# Altium schematic sheet HDMI8x8_InputConnector.SchDoc
size Letter; Date: Not shown in title block; ApprovedBy: Not shown in title block; CheckedBy: Not shown in title block; Author: Not shown in title block; CompanyName: Not shown in title block; Engineer: Not shown in title block; Organization: Not shown in title block; Address1: Not shown in title block; Address2: Not shown in title block; Address3: Not shown in title block; Address4: Not shown in title block; DocumentNumber: 1; Revision: Use project parameter SCH_Rev; SheetNumber: 2; SheetTotal: 3; PageSetup: Record=PageOptions|CenterHorizontal=True|CenterVertical=True|PrintScale=1.00|XCorrection=1.00|YCorrection=1.00|PrintKind=0|BorderSize=5000000|LeftOffset=0|BottomOffset=0|Orientation=2|PaperLength=1000|PaperWidth=1000|Scale=100|PaperSource=15|PrintQuality=600|MediaType=1|DitherType=10|PaperKind=Letter|PrintScaleMode=1; CurrentTime: Not shown in title block; CurrentDate: Not shown in title block; Time: Not shown in title block; DocumentFullPathAndName: Not shown in title block; DocumentName: Not shown in title block; ModifiedDate: Not shown in title block; ImagePath: Not shown in title block
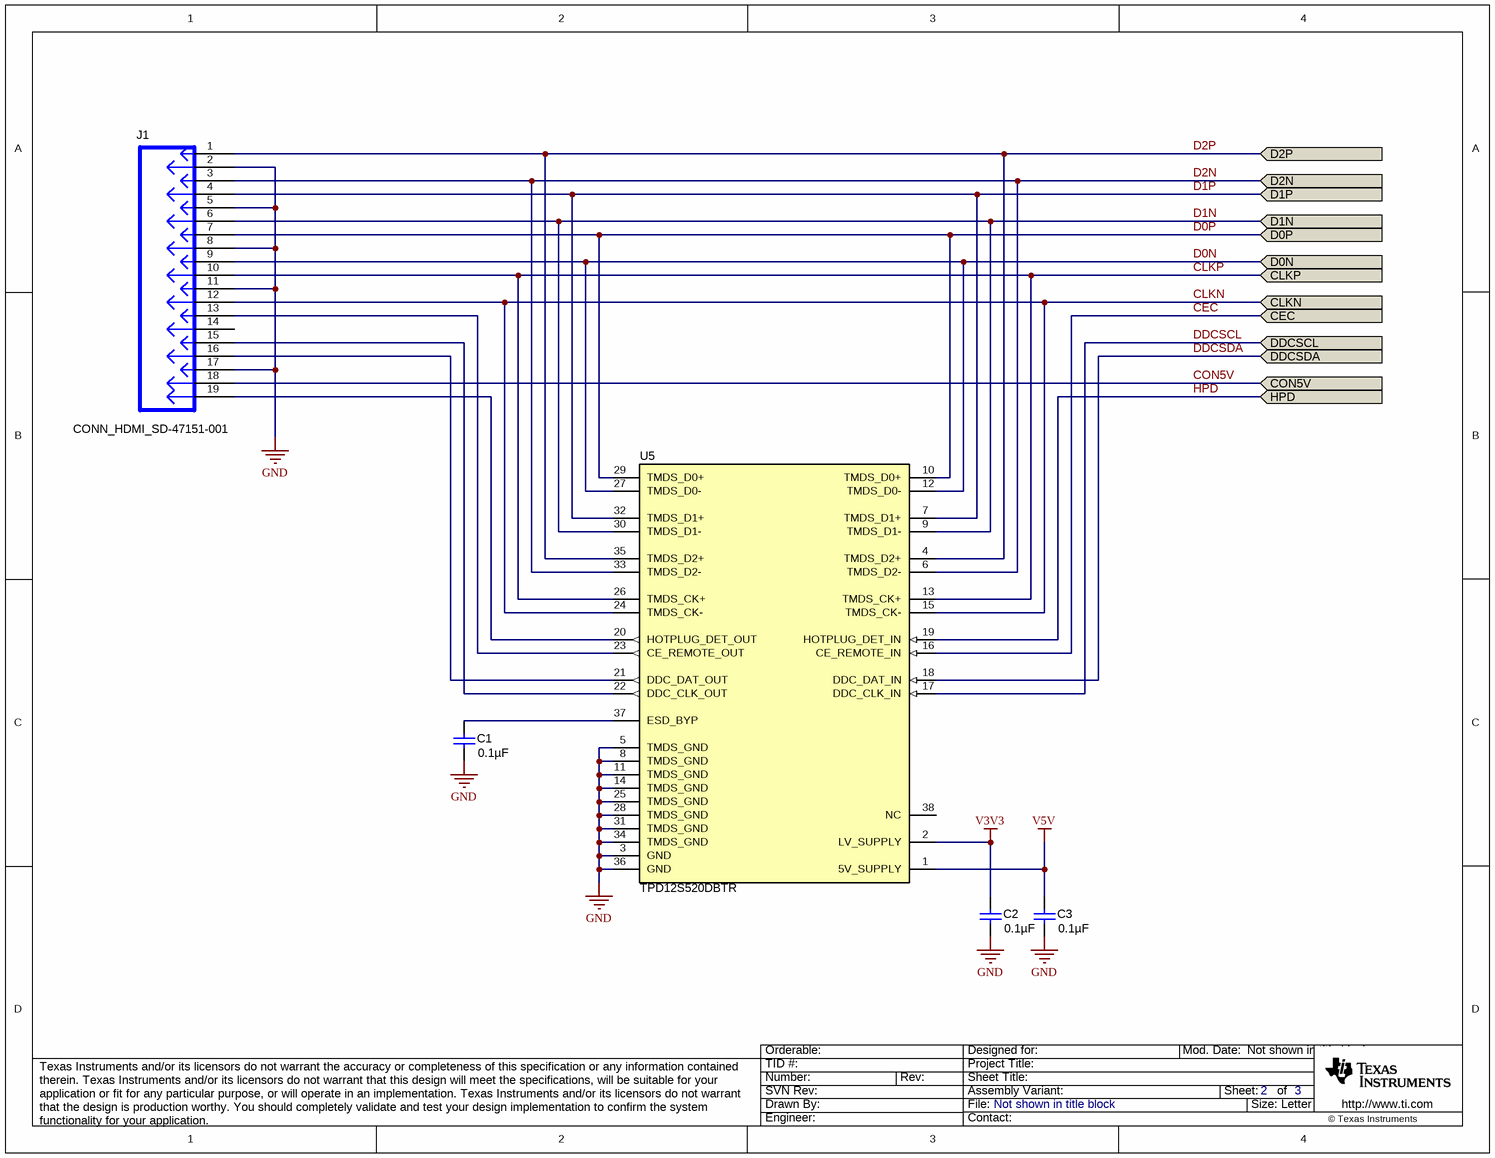
[diagram p0: HDMI8x8_InputConnector.SchDoc]

## Parts
C1  ValueDisplayed: 0.1µF  [0603]  (hidden comment: C0603C104M4RACTU)
C2  ValueDisplayed: 0.1µF  [0603]  (hidden comment: C0603C104M4RACTU)
C3  ValueDisplayed: 0.1µF  [0603]  (hidden comment: C0603C104M4RACTU)
J1  CONN_HDMI_SD-47151-001  [CONN_HDMI_SD-47151]
U5  TPD12S520DBTR  [DBT0038A_N]

## Ports
CEC, CLKN, CLKP, CON5V, D0N, D0P, D1N, D1P, D2N, D2P, DDCSCL, DDCSDA, HPD

## Nets
GND: C1.2 C2.2 C3.2 J1.2 J1.5 J1.8 J1.11 J1.17 U5.3(GND) U5.5(TMDS_GND) U5.8(TMDS_GND) U5.11(TMDS_GND) U5.14(TMDS_GND) U5.25(TMDS_GND) U5.28(TMDS_GND) U5.31(TMDS_GND) U5.34(TMDS_GND) U5.36(GND)
V3V3: C2.1 U5.2(LV_SUPPLY)
V5V: C3.1 U5.1(5V_SUPPLY)
CEC: U5.16(CE_REMOTE_IN) ; port CEC
CLKN: J1.12 U5.15(TMDS_CK-) U5.24(TMDS_CK-) ; port CLKN
CLKP: J1.10 U5.13(TMDS_CK+) U5.26(TMDS_CK+) ; port CLKP
CON5V: J1.18 ; port CON5V
D0N: J1.9 U5.12(TMDS_D0-) U5.27(TMDS_D0-) ; port D0N
D0P: J1.7 U5.10(TMDS_D0+) U5.29(TMDS_D0+) ; port D0P
D1N: J1.6 U5.9(TMDS_D1-) U5.30(TMDS_D1-) ; port D1N
D1P: J1.4 U5.7(TMDS_D1+) U5.32(TMDS_D1+) ; port D1P
D2N: J1.3 U5.6(TMDS_D2-) U5.33(TMDS_D2-) ; port D2N
D2P: J1.1 U5.4(TMDS_D2+) U5.35(TMDS_D2+) ; port D2P
DDCSCL: U5.17(DDC_CLK_IN) ; port DDCSCL
DDCSDA: U5.18(DDC_DAT_IN) ; port DDCSDA
HPD: U5.19(HOTPLUG_DET_IN) ; port HPD
NetC1_1: C1.1 U5.37(ESD_BYP)
NetJ1_13: J1.13 U5.23(CE_REMOTE_OUT)
NetJ1_15: J1.15 U5.22(DDC_CLK_OUT)
NetJ1_16: J1.16 U5.21(DDC_DAT_OUT)
NetJ1_19: J1.19 U5.20(HOTPLUG_DET_OUT)

Not connected (* = marked no-connect by the designer): J1 14; U5 38(NC)

## Notes on the sheet
- Drawn By:
- SVN Rev:
- Number:
- TID #:
- Orderable:
- Rev:
- Sheet Title:
- File:
- Project Title:
- Designed for:
- Assembly Variant:
- Mod. Date:
- Sheet:
- Size:
- of
- Letter
- http://www.ti.com
- Texas Instruments and/or its licensors do not warrant the accuracy or completeness of this specification or any information contained therein. Texas Instruments and/or its licensors do not warrant that this design will meet the specifications, will be suitable for your application or fit for any particular purpose, or will operate in an implementation. Texas Instruments and/or its licensors do not warrant that the design is production worthy. You should completely validate and test your design implementation to confirm the system functionality for your application.
- Engineer:
- Contact:
- © Texas Instruments

## Library data of the parts
C1-C3 = C0603C104M4RACTU: CAP, CERM, 0.1 µF, 16 V, +/- 20%, X7R, 0603; Manufacturer: Kemet; Polarized: N; CompType: Capacitor; Value: 0.1uF; U/M: EA; Cap_F: 0.0000001; Tolerance_%: 20; Value1: Unknown; VDC_V: 16; Value2: 16V; TaMin_C: -55; TaMax_C: 125; AEC Category: Q200; SymbolVersion: 2008-07-09; PartNumber: C0603C104M4RACTU; PackageReference: 0603; RoHS: Y; MountType: SMT; Technology: Ceramic; TempCo: X7R; Cap_Case: 0603; Published: 2008-06-19; Publisher: Texas Instruments; LatestRevisionDate: 2016-01-22; ComponentLink1Description: Datasheet link; ComponentLink1URL: http://www.kemet.com/kemet/web/homepage/kechome.nsf/vapubfiles/F3102_Y5V.pdf/$file/F3102_Y5V.pdf; Supplier 1: Digi-Key; Supplier Part Number 1: 399-1099-1-ND; Supplier 2: Mouser; Supplier Part Number 2: 80-C0603C104M4R; Supplier 3: Farnell; Supplier Part Number 3: 1166968; AEC Qualified: ?
J1 = CONN_HDMI_SD-47151-001: Connector, HDMI, RA, 19 pin; Manufacturer: Molex; PartNumber: SD-47151-0001; area: 255.00 mm; Value: SD-47151-0001; ComponentHeight: 4.5 mm; SymbolVersion: 10/16/2009 11:19:45; ComponentLink1URL: \\vette02\pmp_pcb\pcad_pdf's\471510001_sd.pdf; PackageReference: 12.50 x 15.00 mm; ComponentLink1Description: AEO Datasheet Link
U5 = TPD12S520DBTR: HDMI Receiver Port Protection and Interface Device, 12 Channels, -40 to +85 degC, 38-pin TSSOP (DBT), Green (RoHS & no Sb/Br); Manufacturer: Texas Instruments; Alternate PartNumber: Equivalent; Breakdown Voltage(Min)(V): 9; Differential Capacitance(pF): 0.05; IEC 61000-4-2 Contact(+/- kV): 8; IO Capacitance(Typ)(pF): 0.9; SubFamily: ESD Solution; DatasheetVersion: SLVS640C; PackageVersion: revI, Mar-2011; PackageReference: DBT0038A; PackageDescription: 38-Pin Plastic Small Outline 0.5 mm Pitch; Supplier 1: Digi-Key; Supplier Part Number 1: 296-23617-2-ND; Supplier 2: Digi-Key; Supplier Part Number 2: 296-23617-1-ND; Supplier 3: Digi-Key; Supplier Part Number 3: 296-23617-6-ND; Supplier 4: Newark; Supplier Part Number 4: 85M0176; Supplier 5: Mouser; Supplier Part Number 5: 595-TPD12S520DBTR; Eco-Plan: Green (RoHS & no Sb/Br); IO Leakage Current(nA): 0.05; MountType: SMT; Code_JEDEC: MO-153; PartNumber: TPD12S520DBTR; ComponentLink1Description: Datasheet; ComponentLink1URL: http://www.ti.com/general/docs/lit/getliterature.tsp?genericPartNumber=TPD12S520&fileType=pdf; ComponentLink2Description: URL Link1; ComponentLink2URL: SamplesURL:http://www.ti.com/product/tpd12s520#samples; Alternate Manufacturer: Texas Instruments